# Altium schematic sheet 宁波2号线PIS_数字功率放大器_网络音频板(BHC-A-2030-02)_原理图_V1.0 (21).SchDoc
size 210 x 297 mm; SheetNumber: 0; SheetTotal: 0; PageSetup: Record=PageOptions|CenterHorizontal=True|CenterVertical=True|PrintScale=0.94|XCorrection=1.00|YCorrection=1.00|PrintKind=1|BorderSize=5000000|LeftOffset=0|BottomOffset=0|Orientation=1|PaperLength=2970|PaperWidth=2100|Scale=100|PaperSource=7|PrintQuality=600|MediaType=1|DitherType=10|PaperKind=A4|PrintScaleMode=1
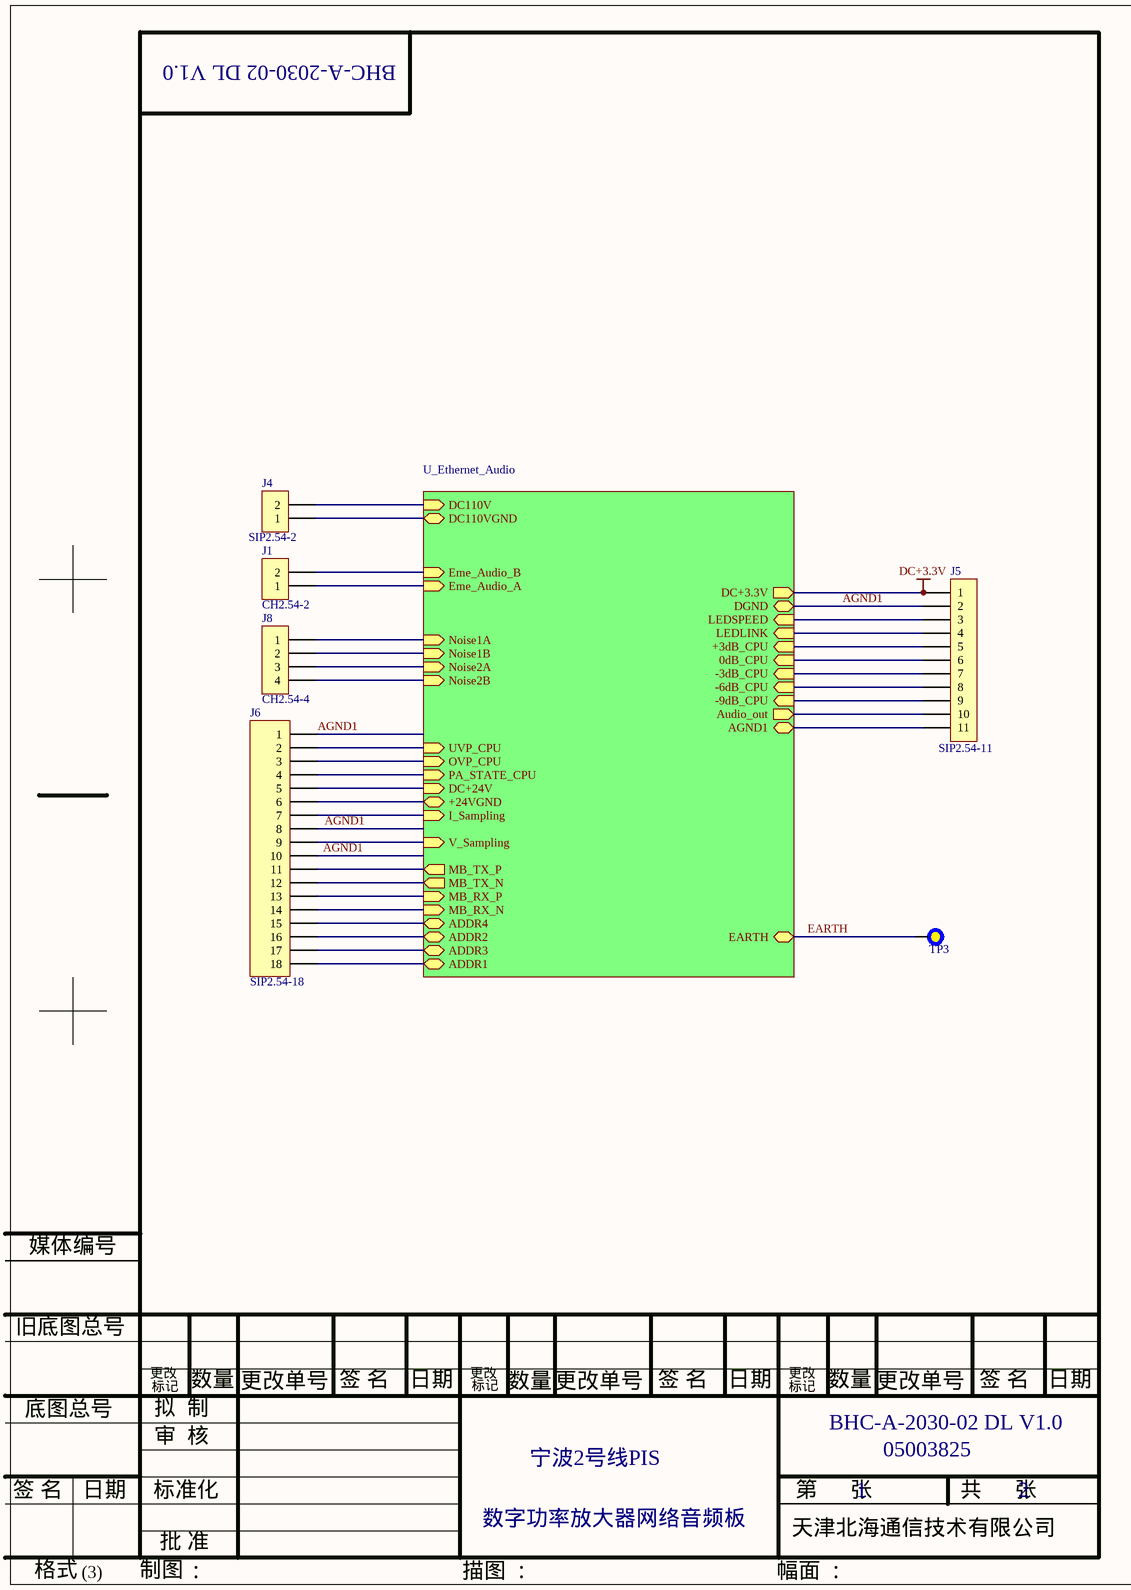
[diagram p0: 宁波2号线PIS_数字功率放大器_网络音频板(BHC-A-2030-02)_原理图_V1.0 (21).SchDoc]

## Parts
J1  value CH2.54-2  [CH2.54-2]  (hidden comment: CON2)
J4  value SIP2.54-2  [SIP2.54-2]  (hidden comment: CON2)
J5  value SIP2.54-11  [SIP2.54-11]  (hidden comment: CON11)
J6  value SIP2.54-18  [SIP2.54-18]  (hidden comment: CON18)
J8  value CH2.54-4  [CH2.54-4]  (hidden comment: CON4)
TP3  TP  [TP]  (value not drawn)

## Sub-sheets
U_Ethernet_Audio = ?: DC110V (in), DC110VGND (bidir), Eme_Audio_A (in), Eme_Audio_B (in), Audio_out (out), AGND1 (bidir), DC+3.3V (out), MB_TX_P (out), MB_TX_N (out), MB_RX_P (in), MB_RX_N (in), Noise1A (in), Noise1B (in), DC+24V (in), Noise2A (in), Noise2B (in), DGND (bidir), V_Sampling (in), I_Sampling (in), ADDR1 (bidir), ADDR2 (bidir), ADDR3 (bidir), ADDR4 (bidir), PA_STATE_CPU (in), OVP_CPU (in), UVP_CPU (in), +24VGND (bidir), EARTH (bidir), +3dB_CPU (in), -3dB_CPU (in), -6dB_CPU (in), -9dB_CPU (in), LEDLINK (in), LEDSPEED (in), 0dB_CPU (in)

## Nets
DC+3.3V: J5.1 ; sheet U_Ethernet_Audio/DC+3.3V
AGND1: J5.2 J6.1 J6.8 J6.10 ; sheet U_Ethernet_Audio/DGND
EARTH: TP3.1 ; sheet U_Ethernet_Audio/EARTH
NetJ1_1: J1.1 ; sheet U_Ethernet_Audio/Eme_Audio_A
NetJ1_2: J1.2 ; sheet U_Ethernet_Audio/Eme_Audio_B
NetJ4_1: J4.1 ; sheet U_Ethernet_Audio/DC110VGND
NetJ4_2: J4.2 ; sheet U_Ethernet_Audio/DC110V
NetJ5_3: J5.3 ; sheet U_Ethernet_Audio/LEDSPEED
NetJ5_4: J5.4 ; sheet U_Ethernet_Audio/LEDLINK
NetJ5_5: J5.5 ; sheet U_Ethernet_Audio/+3dB_CPU
NetJ5_6: J5.6 ; sheet U_Ethernet_Audio/0dB_CPU
NetJ5_7: J5.7 ; sheet U_Ethernet_Audio/-3dB_CPU
NetJ5_8: J5.8 ; sheet U_Ethernet_Audio/-6dB_CPU
NetJ5_9: J5.9 ; sheet U_Ethernet_Audio/-9dB_CPU
NetJ5_10: J5.10 ; sheet U_Ethernet_Audio/Audio_out
NetJ5_11: J5.11 ; sheet U_Ethernet_Audio/AGND1
NetJ6_2: J6.2 ; sheet U_Ethernet_Audio/UVP_CPU
NetJ6_3: J6.3 ; sheet U_Ethernet_Audio/OVP_CPU
NetJ6_4: J6.4 ; sheet U_Ethernet_Audio/PA_STATE_CPU
NetJ6_5: J6.5 ; sheet U_Ethernet_Audio/DC+24V
NetJ6_6: J6.6 ; sheet U_Ethernet_Audio/+24VGND
NetJ6_7: J6.7 ; sheet U_Ethernet_Audio/I_Sampling
NetJ6_9: J6.9 ; sheet U_Ethernet_Audio/V_Sampling
NetJ6_11: J6.11 ; sheet U_Ethernet_Audio/MB_TX_P
NetJ6_12: J6.12 ; sheet U_Ethernet_Audio/MB_TX_N
NetJ6_13: J6.13 ; sheet U_Ethernet_Audio/MB_RX_P
NetJ6_14: J6.14 ; sheet U_Ethernet_Audio/MB_RX_N
NetJ6_15: J6.15 ; sheet U_Ethernet_Audio/ADDR4
NetJ6_16: J6.16 ; sheet U_Ethernet_Audio/ADDR2
NetJ6_17: J6.17 ; sheet U_Ethernet_Audio/ADDR3
NetJ6_18: J6.18 ; sheet U_Ethernet_Audio/ADDR1
NetJ8_1: J8.1 ; sheet U_Ethernet_Audio/Noise1A
NetJ8_2: J8.2 ; sheet U_Ethernet_Audio/Noise1B
NetJ8_3: J8.3 ; sheet U_Ethernet_Audio/Noise2A
NetJ8_4: J8.4 ; sheet U_Ethernet_Audio/Noise2B

## Notes on the sheet
- BHC-A-2030-02 DL V1.0
- 宁波2号线PIS
- 05003825
- 数字功率放大器网络音频板
- 1
- 2
- 媒体编号
- 旧底图总号
- 更改
- 标记
- 数量
- 更改单号
- 签 名
- 日期
- 底图总号
- 拟  制
- 审  核
- 标准化
- 天津北海通信技术有限公司
- 第      张
- 共      张
- 格式
- (3)
- 制图
- 批 准
- ：
- 描图
- 幅面

## Library data of the parts
J1 J4 = CON2: Connector
J6 = CON18: Connector